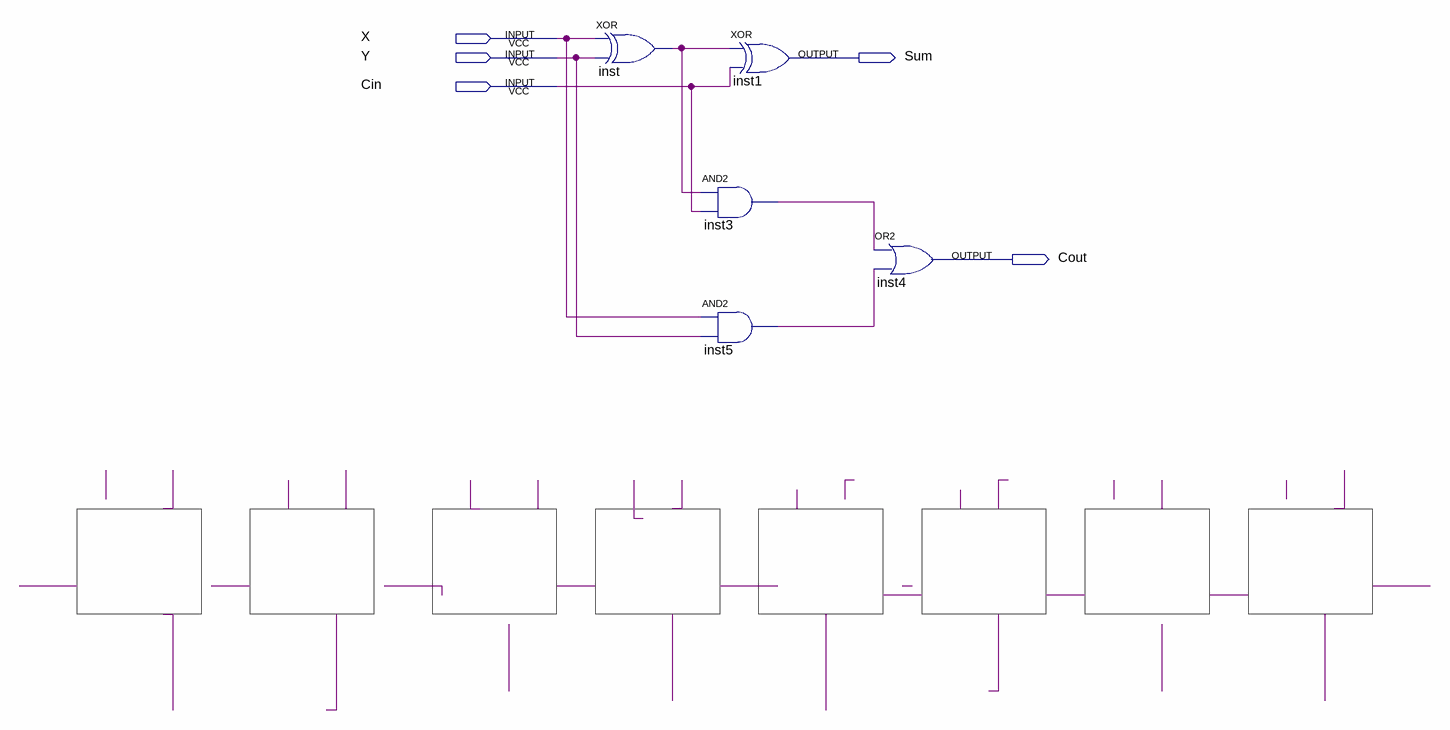
[diagram p0: schematic sheet]
// Quartus schematic RCA_8.bdf as structural Verilog: 5 symbols, 5 pins
module RCA_8 (
  input  X,
  input  Y,
  input  Cin,
  output Sum,
  output Cout
);

  wire inst3_out, inst5_out, inst_out;

  xor inst (inst_out, X, Y);
  and inst3 (inst3_out, inst_out, Cin);
  and inst5 (inst5_out, X, Y);
  // XOR inst1 has open pins: IN1=inst_out, IN2=Cin, OUT=open
  or inst4 (Cout, inst3_out, inst5_out);
endmodule
